# EAGLE schematic audio_unit (EAGLE 8.6.2)
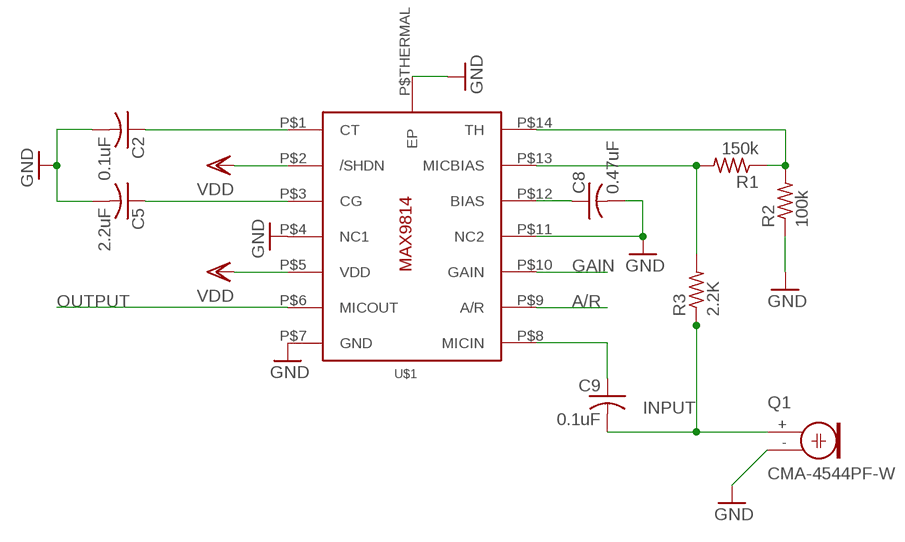
[diagram p0: schematic, sheet 1]

## Parts
C2  0.1uF  C-USC0805K  [C0805K]
C5  2.2uF  C-USC0805K  [C0805K]
C8  0.47uF  C-USC0805K  [C0805K]
C9  0.1uF  C-USC0805K  [C0805K]
Q1  CMA-4544PF-W  ELECTRET  [9.7ELECTRET]
R1  150k  R-US_R0805  [R0805]
R2  100k  R-US_R0805  [R0805]
R3  2.2K  R-US_R0805  [R0805]
U$1  MAX9814TDFN14  [TDFN14_3X3MM]

## Nets
A/R: U$1.P$9(A/R)
GAIN: U$1.P$10(GAIN)
GND: C2.2 C5.2 C8.2 Q1.- R2.1 U$1.P$4(NC1) U$1.P$7(GND) U$1.P$11(NC2) U$1.P$THERMAL(EP)
INPUT: C9.2 Q1.+ R3.1
N$5: C9.1 U$1.P$8(MICIN)
N$7: C8.1 U$1.P$12(BIAS)
N$8: C2.1 U$1.P$1(CT)
N$9: C5.1 U$1.P$3(CG)
N$10: R1.1 R2.2 U$1.P$14(TH)
N$11: R1.2 R3.2 U$1.P$13(MICBIAS)
OUTPUT: U$1.P$6(MICOUT)
VDD: U$1.P$2(/SHDN) U$1.P$5(VDD)

## Library data of the parts
C2 C5 C8 C9 = adafruit:C-US: CAPACITOR, American symbol
Q1 = adafruit:ELECTRET: Electret microphone Thru hole 2.54mm spacing with 9.7mm diameter
R1-R3 = adafruit:R-US_: RESISTOR, American symbol
U$1 = adafruit:MAX9814